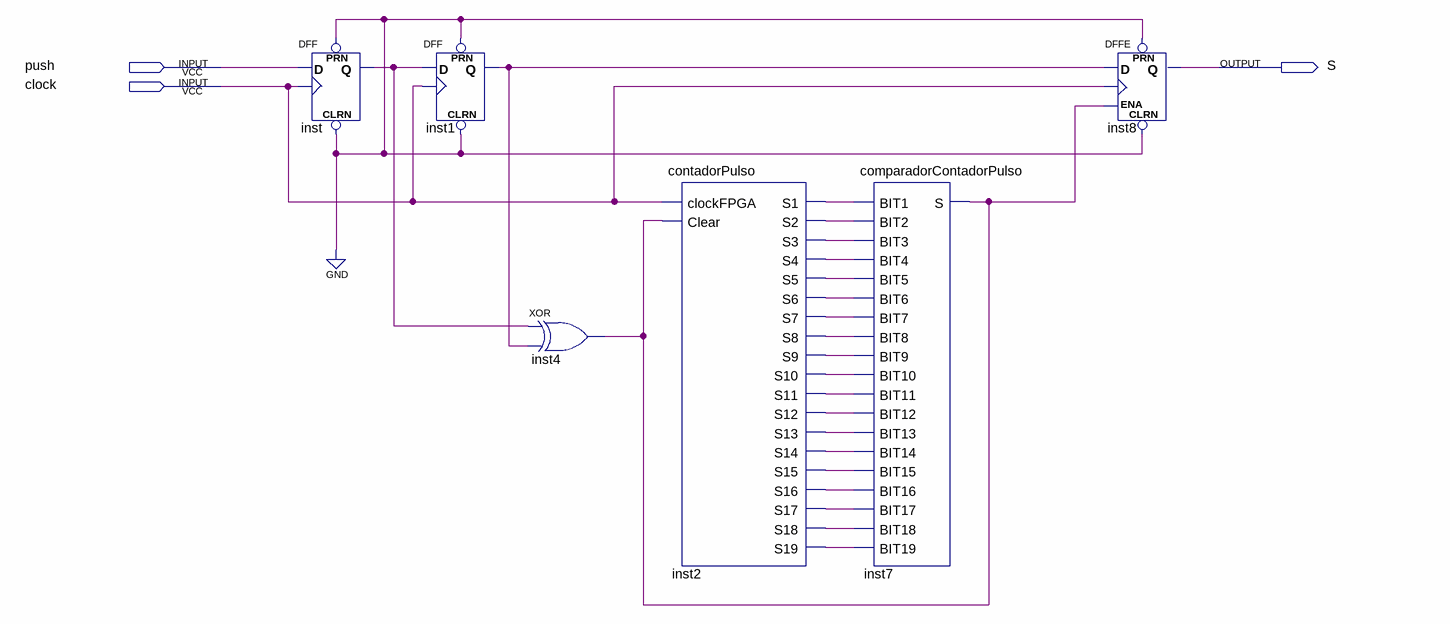
[diagram p0: schematic sheet]
// Quartus schematic debouncer.bdf as structural Verilog: 6 symbols, 3 pins
module debouncer (
  input  push,
  input  clock,
  output S
);

  wire inst1_q, inst2_s1, inst2_s2, inst2_s3, inst2_s4, inst2_s5, inst2_s6, inst2_s7, inst2_s8, inst2_s9,
       inst2_s10, inst2_s11, inst2_s12, inst2_s13, inst2_s14, inst2_s15, inst2_s16, inst2_s17, inst2_s18,
       inst2_s19, inst4_out, inst_q;

  DFF inst (.CLRN(1'b0), .CLK(clock), .D(push), .PRN(1'b0), .Q(inst_q));
  DFF inst1 (.CLRN(1'b0), .CLK(clock), .D(inst_q), .PRN(1'b0), .Q(inst1_q));
  xor inst4 (inst4_out, inst_q, inst1_q);
  contadorPulso inst2 (
    .clockFPGA(clock), .Clear(inst4_out), .S1(inst2_s1), .S2(inst2_s2), .S3(inst2_s3), .S4(inst2_s4),
    .S5(inst2_s5), .S6(inst2_s6), .S7(inst2_s7), .S8(inst2_s8), .S9(inst2_s9), .S10(inst2_s10),
    .S11(inst2_s11), .S12(inst2_s12), .S13(inst2_s13), .S14(inst2_s14), .S15(inst2_s15), .S16(inst2_s16),
    .S17(inst2_s17), .S18(inst2_s18), .S19(inst2_s19));
  comparadorContadorPulso inst7 (
    .BIT1(inst2_s1), .BIT2(inst2_s2), .BIT3(inst2_s3), .BIT4(inst2_s4), .BIT5(inst2_s5), .BIT6(inst2_s6),
    .BIT7(inst2_s7), .BIT8(inst2_s8), .BIT9(inst2_s9), .BIT10(inst2_s10), .BIT11(inst2_s11),
    .BIT12(inst2_s12), .BIT13(inst2_s13), .BIT14(inst2_s14), .BIT15(inst2_s15), .BIT16(inst2_s16),
    .BIT17(inst2_s17), .BIT18(inst2_s18), .BIT19(inst2_s19), .S(inst4_out));
  DFFE inst8 (.PRN(1'b0), .CLRN(1'b0), .D(inst1_q), .CLK(clock), .ENA(inst4_out), .Q(S));
endmodule
